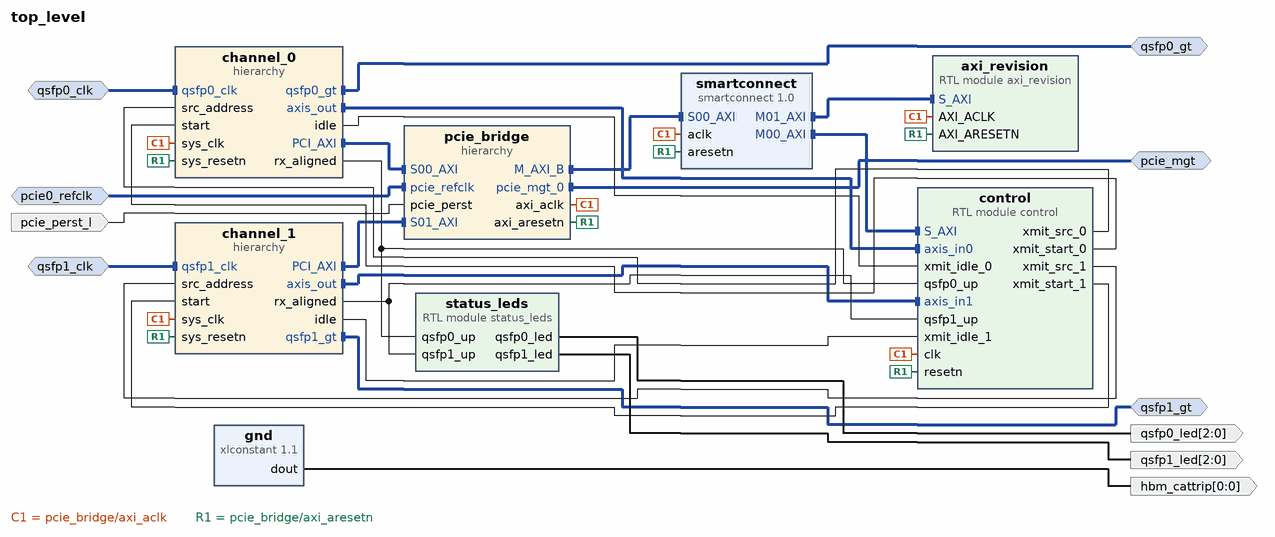
[diagram p0: block diagram of the top level]
# Vivado block design top_level, xcu55c-fsvh2892-2L-e, Vivado 2024.2
create_bd_design top_level

create_bd_intf_port -mode Slave -vlnv xilinx.com:interface:diff_clock_rtl:1.0 pcie0_refclk
create_bd_intf_port -mode Master -vlnv xilinx.com:interface:pcie_7x_mgt_rtl:1.0 pcie_mgt
create_bd_intf_port -mode Master -vlnv xilinx.com:interface:gt_rtl:1.0 qsfp0_gt
create_bd_intf_port -mode Slave -vlnv xilinx.com:interface:diff_clock_rtl:1.0 qsfp0_clk
set_property -dict {CONFIG.FREQ_HZ 161132812} [get_bd_intf_ports qsfp0_clk]
create_bd_intf_port -mode Master -vlnv xilinx.com:interface:gt_rtl:1.0 qsfp1_gt
create_bd_intf_port -mode Slave -vlnv xilinx.com:interface:diff_clock_rtl:1.0 qsfp1_clk
set_property -dict {CONFIG.FREQ_HZ 161132812} [get_bd_intf_ports qsfp1_clk]
create_bd_port -dir I -type rst pcie_perst_l
create_bd_port -dir O -from 0 -to 0 hbm_cattrip
create_bd_port -dir O -from 2 -to 0 qsfp0_led
create_bd_port -dir O -from 2 -to 0 qsfp1_led

create_bd_cell -type hier pcie_bridge
create_bd_cell -type ip -vlnv xilinx.com:ip:smartconnect:1.0 smartconnect
set_property -dict {CONFIG.NUM_MI 2 CONFIG.NUM_SI 1} [get_bd_cells smartconnect]
create_bd_cell -type ip -vlnv xilinx.com:ip:xlconstant:1.1 gnd
set_property -dict {CONFIG.CONST_VAL 0} [get_bd_cells gnd]
create_bd_cell -type module -reference control control
create_bd_cell -type module -reference status_leds status_leds
create_bd_cell -type hier channel_0
create_bd_cell -type hier channel_1
create_bd_cell -type module -reference axi_revision axi_revision

# ---- hierarchy /pcie_bridge ----
current_bd_instance /pcie_bridge
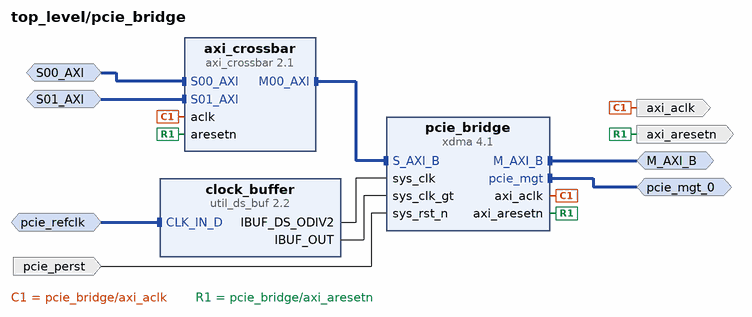
[diagram p1: block diagram inside /pcie_bridge]
create_bd_intf_pin -mode Master -vlnv xilinx.com:interface:pcie_7x_mgt_rtl:1.0 pcie_mgt_0
create_bd_intf_pin -mode Slave -vlnv xilinx.com:interface:diff_clock_rtl:1.0 pcie_refclk
create_bd_intf_pin -mode Master -vlnv xilinx.com:interface:aximm_rtl:1.0 M_AXI_B
create_bd_intf_pin -mode Slave -vlnv xilinx.com:interface:aximm_rtl:1.0 S00_AXI
create_bd_intf_pin -mode Slave -vlnv xilinx.com:interface:aximm_rtl:1.0 S01_AXI
create_bd_pin -dir I -type rst pcie_perst
create_bd_pin -dir O axi_aclk
create_bd_pin -dir O axi_aresetn

create_bd_cell -type ip -vlnv xilinx.com:ip:xdma:4.1 pcie_bridge
set_property -dict [list \
  CONFIG.PF0_DEVICE_ID_mqdma 9048 \
  CONFIG.PF0_SRIOV_VF_DEVICE_ID A048 \
  CONFIG.PF2_DEVICE_ID_mqdma 9248 \
  CONFIG.PF3_DEVICE_ID_mqdma 9348 \
  CONFIG.axi_addr_width 64 \
  CONFIG.axi_data_width 512_bit \
  CONFIG.axisten_freq 250 \
  CONFIG.bridge_burst true \
  CONFIG.en_axi_slave_if true \
  CONFIG.en_gt_selection false \
  CONFIG.functional_mode AXI_Bridge \
  CONFIG.mode_selection Advanced \
  CONFIG.pcie_blk_locn PCIE4C_X1Y1 \
  CONFIG.pf0_bar0_scale Megabytes \
  CONFIG.pf0_bar0_size 1 \
  CONFIG.pf0_device_id 903f \
  CONFIG.pf0_msi_enabled false \
  CONFIG.pl_link_cap_max_link_speed 16.0_GT/s \
  CONFIG.pl_link_cap_max_link_width X8 \
  CONFIG.runbit_fix false \
  CONFIG.xlnx_ref_board None \
] [get_bd_cells pcie_bridge]
create_bd_cell -type ip -vlnv xilinx.com:ip:util_ds_buf:2.2 clock_buffer
set_property -dict {CONFIG.C_BUF_TYPE IBUFDSGTE} [get_bd_cells clock_buffer]
create_bd_cell -type ip -vlnv xilinx.com:ip:axi_crossbar:2.1 axi_crossbar
set_property -dict [list \
  CONFIG.M00_S00_WRITE_CONNECTIVITY 0 \
  CONFIG.M00_S01_WRITE_CONNECTIVITY 0 \
  CONFIG.NUM_MI 1 \
  CONFIG.NUM_SI 2 \
  CONFIG.STRATEGY 2 \
] [get_bd_cells axi_crossbar]

# ---- hierarchy /channel_0 ----
current_bd_instance /channel_0
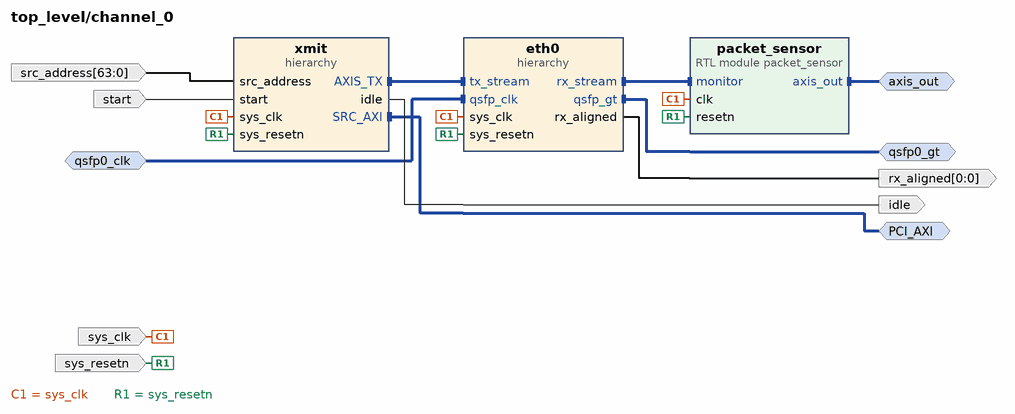
[diagram p2: block diagram inside /channel_0]
create_bd_intf_pin -mode Master -vlnv xilinx.com:interface:gt_rtl:1.0 qsfp0_gt
create_bd_intf_pin -mode Slave -vlnv xilinx.com:interface:diff_clock_rtl:1.0 qsfp0_clk
create_bd_intf_pin -mode Master -vlnv xilinx.com:interface:axis_rtl:1.0 axis_out
create_bd_intf_pin -mode Master -vlnv xilinx.com:interface:aximm_rtl:1.0 PCI_AXI
create_bd_pin -dir I sys_clk
create_bd_pin -dir I sys_resetn
create_bd_pin -dir O -from 0 -to 0 rx_aligned
create_bd_pin -dir I start
create_bd_pin -dir I -from 63 -to 0 src_address
create_bd_pin -dir O idle

create_bd_cell -type module -reference packet_sensor packet_sensor
create_bd_cell -type hier eth0
create_bd_cell -type hier xmit

# ---- hierarchy /channel_0/eth0 ----
current_bd_instance /channel_0/eth0
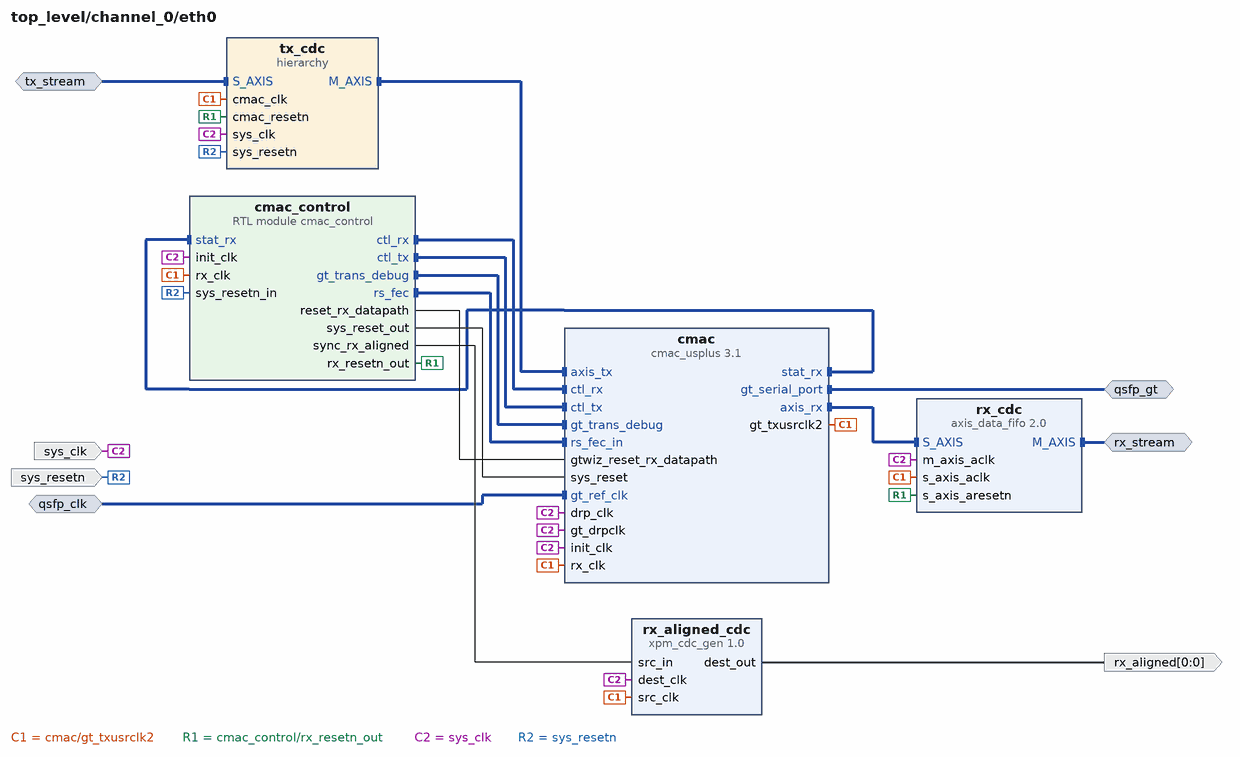
[diagram p3: block diagram inside /channel_0/eth0]
create_bd_intf_pin -mode Master -vlnv xilinx.com:interface:gt_rtl:1.0 qsfp_gt
create_bd_intf_pin -mode Slave -vlnv xilinx.com:interface:diff_clock_rtl:1.0 qsfp_clk
create_bd_intf_pin -mode Master -vlnv xilinx.com:interface:axis_rtl:1.0 rx_stream
create_bd_intf_pin -mode Slave -vlnv xilinx.com:interface:axis_rtl:1.0 tx_stream
create_bd_pin -dir I sys_clk
create_bd_pin -dir I sys_resetn
create_bd_pin -dir O -from 0 -to 0 rx_aligned

create_bd_cell -type ip -vlnv xilinx.com:ip:cmac_usplus:3.1 cmac
set_property -dict [list \
  CONFIG.ADD_GT_CNRL_STS_PORTS 1 \
  CONFIG.CMAC_CAUI4_MODE 1 \
  CONFIG.GT_DRP_CLK 250 \
  CONFIG.INCLUDE_RS_FEC 1 \
  CONFIG.RX_FLOW_CONTROL 0 \
  CONFIG.TX_FLOW_CONTROL 0 \
  CONFIG.USER_INTERFACE AXIS \
] [get_bd_cells cmac]
create_bd_cell -type module -reference cmac_control cmac_control
create_bd_cell -type ip -vlnv xilinx.com:ip:axis_data_fifo:2.0 rx_cdc
set_property -dict {CONFIG.IS_ACLK_ASYNC 1} [get_bd_cells rx_cdc]
create_bd_cell -type ip -vlnv xilinx.com:ip:xpm_cdc_gen:1.0 rx_aligned_cdc
set_property -dict [list \
  CONFIG.CDC_TYPE xpm_cdc_single \
  CONFIG.SIM_ASSERT_CHK false \
  CONFIG.SRC_INPUT_REG false \
] [get_bd_cells rx_aligned_cdc]
create_bd_cell -type hier tx_cdc

# ---- hierarchy /channel_0/eth0/tx_cdc ----
current_bd_instance /channel_0/eth0/tx_cdc
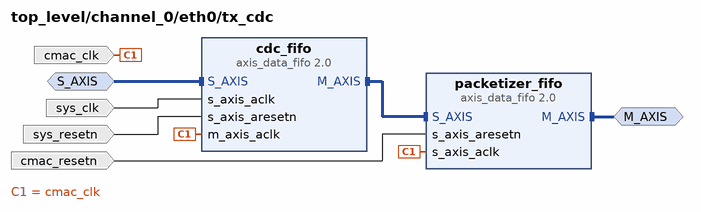
[diagram p4: block diagram inside /channel_0/eth0/tx_cdc]
create_bd_intf_pin -mode Slave -vlnv xilinx.com:interface:axis_rtl:1.0 S_AXIS
create_bd_intf_pin -mode Master -vlnv xilinx.com:interface:axis_rtl:1.0 M_AXIS
create_bd_pin -dir I sys_resetn
create_bd_pin -dir I sys_clk
create_bd_pin -dir I -type clk cmac_clk
create_bd_pin -dir I -type rst cmac_resetn

create_bd_cell -type ip -vlnv xilinx.com:ip:axis_data_fifo:2.0 cdc_fifo
set_property -dict {CONFIG.FIFO_DEPTH 16 CONFIG.IS_ACLK_ASYNC 1} [get_bd_cells cdc_fifo]
create_bd_cell -type ip -vlnv xilinx.com:ip:axis_data_fifo:2.0 packetizer_fifo
set_property -dict {CONFIG.FIFO_MODE 2} [get_bd_cells packetizer_fifo]

# ---- hierarchy /channel_0/xmit ----
current_bd_instance /channel_0/xmit
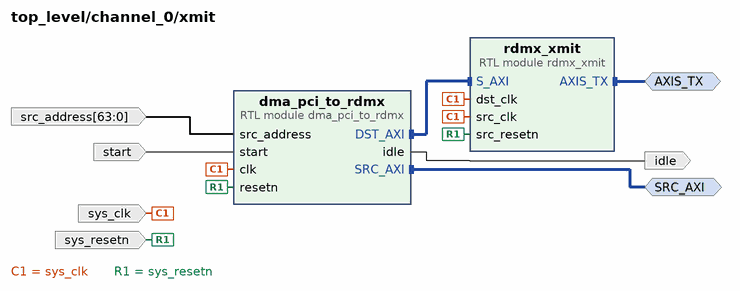
[diagram p5: block diagram inside /channel_0/xmit]
create_bd_intf_pin -mode Master -vlnv xilinx.com:interface:aximm_rtl:1.0 SRC_AXI
create_bd_intf_pin -mode Master -vlnv xilinx.com:interface:axis_rtl:1.0 AXIS_TX
create_bd_pin -dir I sys_clk
create_bd_pin -dir I sys_resetn
create_bd_pin -dir I -from 63 -to 0 src_address
create_bd_pin -dir I start
create_bd_pin -dir O idle

create_bd_cell -type module -reference dma_pci_to_rdmx dma_pci_to_rdmx
create_bd_cell -type module -reference rdmx_xmit rdmx_xmit
set_property -dict {CONFIG.SRC_MAC 0} [get_bd_cells rdmx_xmit]

# ---- hierarchy /channel_1 ----
current_bd_instance /channel_1
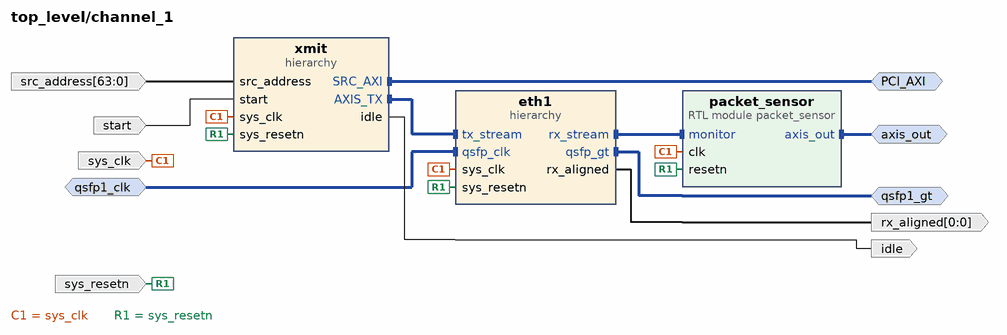
[diagram p6: block diagram inside /channel_1]
create_bd_intf_pin -mode Master -vlnv xilinx.com:interface:axis_rtl:1.0 axis_out
create_bd_intf_pin -mode Master -vlnv xilinx.com:interface:gt_rtl:1.0 qsfp1_gt
create_bd_intf_pin -mode Slave -vlnv xilinx.com:interface:diff_clock_rtl:1.0 qsfp1_clk
create_bd_intf_pin -mode Master -vlnv xilinx.com:interface:aximm_rtl:1.0 PCI_AXI
create_bd_pin -dir I sys_clk
create_bd_pin -dir I sys_resetn
create_bd_pin -dir O -from 0 -to 0 rx_aligned
create_bd_pin -dir I -from 63 -to 0 src_address
create_bd_pin -dir I start
create_bd_pin -dir O idle

create_bd_cell -type module -reference packet_sensor packet_sensor
create_bd_cell -type hier eth1
create_bd_cell -type hier xmit

# ---- hierarchy /channel_1/eth1 ----
current_bd_instance /channel_1/eth1
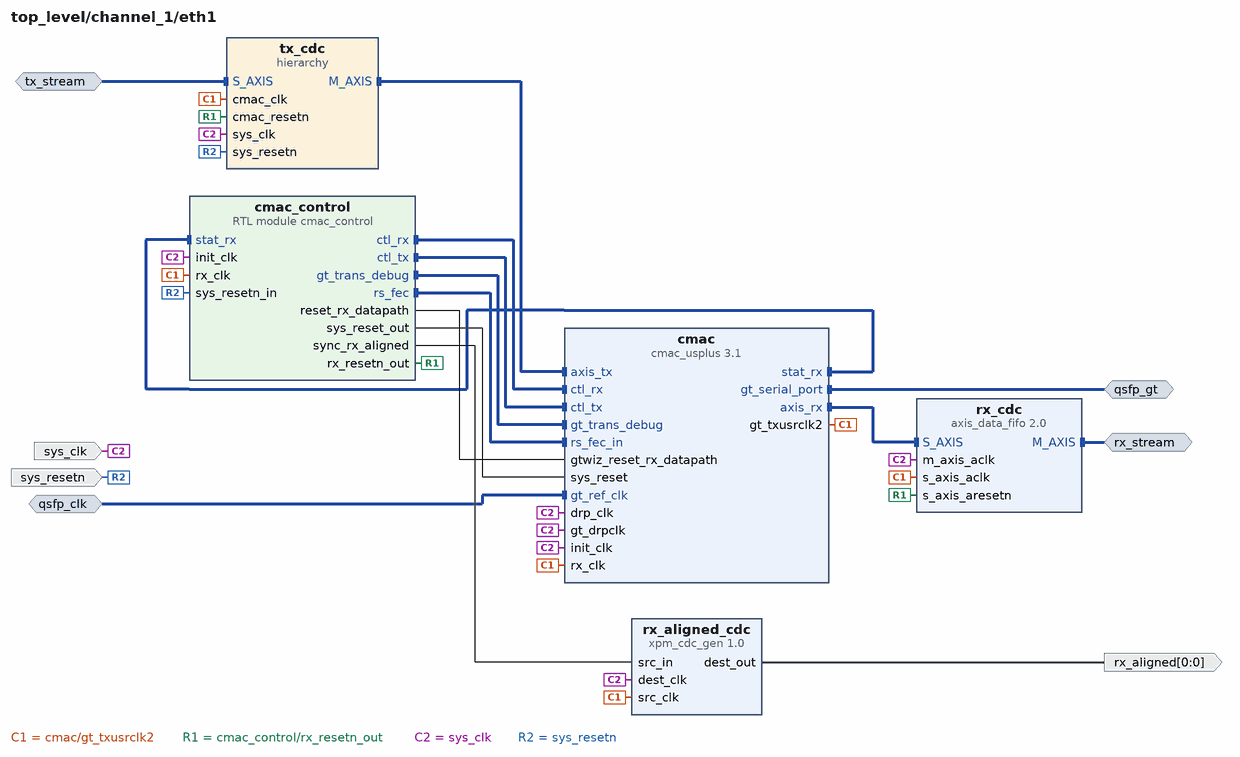
[diagram p7: block diagram inside /channel_1/eth1]
create_bd_intf_pin -mode Master -vlnv xilinx.com:interface:gt_rtl:1.0 qsfp_gt
create_bd_intf_pin -mode Slave -vlnv xilinx.com:interface:diff_clock_rtl:1.0 qsfp_clk
create_bd_intf_pin -mode Master -vlnv xilinx.com:interface:axis_rtl:1.0 rx_stream
create_bd_intf_pin -mode Slave -vlnv xilinx.com:interface:axis_rtl:1.0 tx_stream
create_bd_pin -dir I sys_clk
create_bd_pin -dir I sys_resetn
create_bd_pin -dir O -from 0 -to 0 rx_aligned

create_bd_cell -type ip -vlnv xilinx.com:ip:cmac_usplus:3.1 cmac
set_property -dict [list \
  CONFIG.ADD_GT_CNRL_STS_PORTS 1 \
  CONFIG.CMAC_CAUI4_MODE 1 \
  CONFIG.CMAC_CORE_SELECT CMACE4_X0Y4 \
  CONFIG.GT_DRP_CLK 250 \
  CONFIG.GT_GROUP_SELECT {X0Y28~X0Y31} \
  CONFIG.INCLUDE_RS_FEC 1 \
  CONFIG.RX_FLOW_CONTROL 0 \
  CONFIG.TX_FLOW_CONTROL 0 \
  CONFIG.USER_INTERFACE AXIS \
] [get_bd_cells cmac]
create_bd_cell -type module -reference cmac_control cmac_control
create_bd_cell -type ip -vlnv xilinx.com:ip:axis_data_fifo:2.0 rx_cdc
set_property -dict {CONFIG.IS_ACLK_ASYNC 1} [get_bd_cells rx_cdc]
create_bd_cell -type ip -vlnv xilinx.com:ip:xpm_cdc_gen:1.0 rx_aligned_cdc
set_property -dict [list \
  CONFIG.CDC_TYPE xpm_cdc_single \
  CONFIG.SIM_ASSERT_CHK false \
  CONFIG.SRC_INPUT_REG false \
] [get_bd_cells rx_aligned_cdc]
create_bd_cell -type hier tx_cdc

# ---- hierarchy /channel_1/eth1/tx_cdc ----
current_bd_instance /channel_1/eth1/tx_cdc
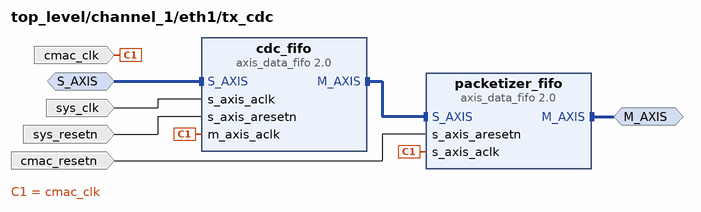
[diagram p8: block diagram inside /channel_1/eth1/tx_cdc]
create_bd_intf_pin -mode Slave -vlnv xilinx.com:interface:axis_rtl:1.0 S_AXIS
create_bd_intf_pin -mode Master -vlnv xilinx.com:interface:axis_rtl:1.0 M_AXIS
create_bd_pin -dir I sys_resetn
create_bd_pin -dir I sys_clk
create_bd_pin -dir I -type clk cmac_clk
create_bd_pin -dir I -type rst cmac_resetn

create_bd_cell -type ip -vlnv xilinx.com:ip:axis_data_fifo:2.0 cdc_fifo
set_property -dict {CONFIG.FIFO_DEPTH 16 CONFIG.IS_ACLK_ASYNC 1} [get_bd_cells cdc_fifo]
create_bd_cell -type ip -vlnv xilinx.com:ip:axis_data_fifo:2.0 packetizer_fifo
set_property -dict {CONFIG.FIFO_MODE 2} [get_bd_cells packetizer_fifo]

# ---- hierarchy /channel_1/xmit ----
current_bd_instance /channel_1/xmit
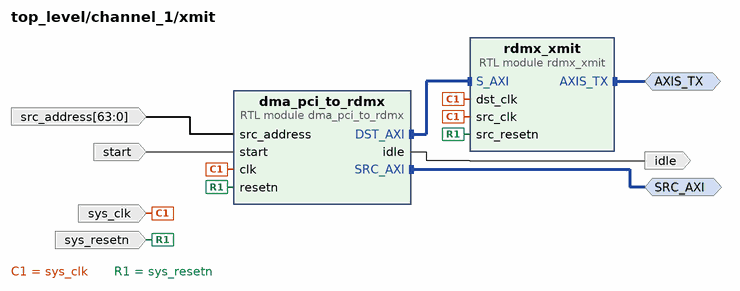
[diagram p9: block diagram inside /channel_1/xmit]
create_bd_intf_pin -mode Master -vlnv xilinx.com:interface:aximm_rtl:1.0 SRC_AXI
create_bd_intf_pin -mode Master -vlnv xilinx.com:interface:axis_rtl:1.0 AXIS_TX
create_bd_pin -dir I sys_clk
create_bd_pin -dir I sys_resetn
create_bd_pin -dir I -from 63 -to 0 src_address
create_bd_pin -dir I start
create_bd_pin -dir O idle

create_bd_cell -type module -reference dma_pci_to_rdmx dma_pci_to_rdmx
create_bd_cell -type module -reference rdmx_xmit rdmx_xmit
set_property -dict {CONFIG.SRC_MAC 1} [get_bd_cells rdmx_xmit]

# ---- connections ----

current_bd_instance /pcie_bridge
connect_bd_intf_net [get_bd_intf_pins pcie_refclk] [get_bd_intf_pins clock_buffer/CLK_IN_D]
connect_bd_intf_net [get_bd_intf_pins S00_AXI] [get_bd_intf_pins axi_crossbar/S00_AXI]
connect_bd_intf_net [get_bd_intf_pins S01_AXI] [get_bd_intf_pins axi_crossbar/S01_AXI]
connect_bd_intf_net [get_bd_intf_pins axi_crossbar/M00_AXI] [get_bd_intf_pins pcie_bridge/S_AXI_B]
connect_bd_intf_net [get_bd_intf_pins M_AXI_B] [get_bd_intf_pins pcie_bridge/M_AXI_B]
connect_bd_intf_net [get_bd_intf_pins pcie_mgt_0] [get_bd_intf_pins pcie_bridge/pcie_mgt]
connect_bd_net -net sys_rst_n_0_1 [get_bd_pins pcie_perst] [get_bd_pins pcie_bridge/sys_rst_n]
connect_bd_net -net util_ds_buf_0_IBUF_DS_ODIV2 [get_bd_pins clock_buffer/IBUF_DS_ODIV2] [get_bd_pins pcie_bridge/sys_clk]
connect_bd_net -net util_ds_buf_0_IBUF_OUT [get_bd_pins clock_buffer/IBUF_OUT] [get_bd_pins pcie_bridge/sys_clk_gt]
connect_bd_net -net xdma_0_axi_aclk [get_bd_pins pcie_bridge/axi_aclk] [get_bd_pins axi_aclk] [get_bd_pins axi_crossbar/aclk]
connect_bd_net -net xdma_0_axi_aresetn [get_bd_pins pcie_bridge/axi_aresetn] [get_bd_pins axi_aresetn] [get_bd_pins axi_crossbar/aresetn]

current_bd_instance /channel_0
connect_bd_intf_net [get_bd_intf_pins qsfp0_gt] [get_bd_intf_pins eth0/qsfp_gt]
connect_bd_intf_net [get_bd_intf_pins packet_sensor/monitor] [get_bd_intf_pins eth0/rx_stream]
connect_bd_intf_net [get_bd_intf_pins axis_out] [get_bd_intf_pins packet_sensor/axis_out]
connect_bd_intf_net [get_bd_intf_pins qsfp0_clk] [get_bd_intf_pins eth0/qsfp_clk]
connect_bd_intf_net [get_bd_intf_pins xmit/AXIS_TX] [get_bd_intf_pins eth0/tx_stream]
connect_bd_intf_net [get_bd_intf_pins PCI_AXI] [get_bd_intf_pins xmit/SRC_AXI]
connect_bd_net [get_bd_pins eth0/rx_aligned] [get_bd_pins rx_aligned]
connect_bd_net -net pcie_bridge_0_axi_aclk [get_bd_pins sys_clk] [get_bd_pins eth0/sys_clk] [get_bd_pins packet_sensor/clk] [get_bd_pins xmit/sys_clk]
connect_bd_net -net pcie_bridge_0_axi_aresetn [get_bd_pins sys_resetn] \
  [get_bd_pins eth0/sys_resetn] [get_bd_pins packet_sensor/resetn] [get_bd_pins xmit/sys_resetn]
connect_bd_net [get_bd_pins src_address] [get_bd_pins xmit/src_address]
connect_bd_net [get_bd_pins start] [get_bd_pins xmit/start]
connect_bd_net [get_bd_pins xmit/idle] [get_bd_pins idle]

current_bd_instance /channel_0/eth0
connect_bd_intf_net [get_bd_intf_pins cmac/axis_rx] [get_bd_intf_pins rx_cdc/S_AXIS]
connect_bd_intf_net [get_bd_intf_pins cmac_control/ctl_rx] [get_bd_intf_pins cmac/ctl_rx]
connect_bd_intf_net [get_bd_intf_pins cmac_control/ctl_tx] [get_bd_intf_pins cmac/ctl_tx]
connect_bd_intf_net [get_bd_intf_pins cmac_control/gt_trans_debug] [get_bd_intf_pins cmac/gt_trans_debug]
connect_bd_intf_net [get_bd_intf_pins cmac_control/rs_fec] [get_bd_intf_pins cmac/rs_fec_in]
connect_bd_intf_net [get_bd_intf_pins qsfp_gt] [get_bd_intf_pins cmac/gt_serial_port]
connect_bd_intf_net [get_bd_intf_pins cmac_control/stat_rx] [get_bd_intf_pins cmac/stat_rx]
connect_bd_intf_net [get_bd_intf_pins tx_cdc/M_AXIS] [get_bd_intf_pins cmac/axis_tx]
connect_bd_intf_net [get_bd_intf_pins qsfp_clk] [get_bd_intf_pins cmac/gt_ref_clk]
connect_bd_intf_net [get_bd_intf_pins rx_stream] [get_bd_intf_pins rx_cdc/M_AXIS]
connect_bd_intf_net [get_bd_intf_pins tx_stream] [get_bd_intf_pins tx_cdc/S_AXIS]
connect_bd_net [get_bd_pins cmac/gt_txusrclk2] \
  [get_bd_pins cmac_control/rx_clk] [get_bd_pins cmac/rx_clk] [get_bd_pins rx_cdc/s_axis_aclk] \
  [get_bd_pins rx_aligned_cdc/src_clk] [get_bd_pins tx_cdc/cmac_clk]
connect_bd_net [get_bd_pins cmac_control/reset_rx_datapath] [get_bd_pins cmac/gtwiz_reset_rx_datapath]
connect_bd_net [get_bd_pins cmac_control/rx_resetn_out] [get_bd_pins rx_cdc/s_axis_aresetn] [get_bd_pins tx_cdc/cmac_resetn]
connect_bd_net [get_bd_pins cmac_control/sync_rx_aligned] [get_bd_pins rx_aligned_cdc/src_in]
connect_bd_net [get_bd_pins cmac_control/sys_reset_out] [get_bd_pins cmac/sys_reset]
connect_bd_net [get_bd_pins rx_aligned_cdc/dest_out] [get_bd_pins rx_aligned]
connect_bd_net [get_bd_pins sys_clk] \
  [get_bd_pins cmac/drp_clk] [get_bd_pins cmac/init_clk] [get_bd_pins cmac/gt_drpclk] [get_bd_pins cmac_control/init_clk] \
  [get_bd_pins rx_cdc/m_axis_aclk] [get_bd_pins rx_aligned_cdc/dest_clk] [get_bd_pins tx_cdc/sys_clk]
connect_bd_net [get_bd_pins sys_resetn] [get_bd_pins cmac_control/sys_resetn_in] [get_bd_pins tx_cdc/sys_resetn]

current_bd_instance /channel_0/eth0/tx_cdc
connect_bd_intf_net [get_bd_intf_pins cdc_fifo/M_AXIS] [get_bd_intf_pins packetizer_fifo/S_AXIS]
connect_bd_intf_net [get_bd_intf_pins M_AXIS] [get_bd_intf_pins packetizer_fifo/M_AXIS]
connect_bd_intf_net [get_bd_intf_pins S_AXIS] [get_bd_intf_pins cdc_fifo/S_AXIS]
connect_bd_net [get_bd_pins cmac_clk] [get_bd_pins packetizer_fifo/s_axis_aclk] [get_bd_pins cdc_fifo/m_axis_aclk]
connect_bd_net -net cmac_control_rx_resetn_out [get_bd_pins cmac_resetn] [get_bd_pins packetizer_fifo/s_axis_aresetn]
connect_bd_net [get_bd_pins sys_clk] [get_bd_pins cdc_fifo/s_axis_aclk]
connect_bd_net [get_bd_pins sys_resetn] [get_bd_pins cdc_fifo/s_axis_aresetn]

current_bd_instance /channel_0/xmit
connect_bd_intf_net [get_bd_intf_pins dma_pci_to_rdmx/DST_AXI] [get_bd_intf_pins rdmx_xmit/S_AXI]
connect_bd_intf_net [get_bd_intf_pins SRC_AXI] [get_bd_intf_pins dma_pci_to_rdmx/SRC_AXI]
connect_bd_intf_net [get_bd_intf_pins AXIS_TX] [get_bd_intf_pins rdmx_xmit/AXIS_TX]
connect_bd_net [get_bd_pins dma_pci_to_rdmx/idle] [get_bd_pins idle]
connect_bd_net -net pcie_bridge_0_axi_aclk [get_bd_pins sys_clk] \
  [get_bd_pins rdmx_xmit/dst_clk] [get_bd_pins rdmx_xmit/src_clk] [get_bd_pins dma_pci_to_rdmx/clk]
connect_bd_net -net pcie_bridge_0_axi_aresetn [get_bd_pins sys_resetn] [get_bd_pins rdmx_xmit/src_resetn] [get_bd_pins dma_pci_to_rdmx/resetn]
connect_bd_net [get_bd_pins src_address] [get_bd_pins dma_pci_to_rdmx/src_address]
connect_bd_net [get_bd_pins start] [get_bd_pins dma_pci_to_rdmx/start]

current_bd_instance /channel_1
connect_bd_intf_net [get_bd_intf_pins PCI_AXI] [get_bd_intf_pins xmit/SRC_AXI]
connect_bd_intf_net [get_bd_intf_pins qsfp1_gt] [get_bd_intf_pins eth1/qsfp_gt]
connect_bd_intf_net [get_bd_intf_pins packet_sensor/monitor] [get_bd_intf_pins eth1/rx_stream]
connect_bd_intf_net [get_bd_intf_pins axis_out] [get_bd_intf_pins packet_sensor/axis_out]
connect_bd_intf_net [get_bd_intf_pins qsfp1_clk] [get_bd_intf_pins eth1/qsfp_clk]
connect_bd_intf_net [get_bd_intf_pins xmit/AXIS_TX] [get_bd_intf_pins eth1/tx_stream]
connect_bd_net [get_bd_pins eth1/rx_aligned] [get_bd_pins rx_aligned]
connect_bd_net -net pcie_bridge_0_axi_aclk [get_bd_pins sys_clk] [get_bd_pins eth1/sys_clk] [get_bd_pins packet_sensor/clk] [get_bd_pins xmit/sys_clk]
connect_bd_net -net pcie_bridge_0_axi_aresetn [get_bd_pins sys_resetn] \
  [get_bd_pins eth1/sys_resetn] [get_bd_pins packet_sensor/resetn] [get_bd_pins xmit/sys_resetn]
connect_bd_net [get_bd_pins src_address] [get_bd_pins xmit/src_address]
connect_bd_net [get_bd_pins start] [get_bd_pins xmit/start]
connect_bd_net [get_bd_pins xmit/idle] [get_bd_pins idle]

current_bd_instance /channel_1/eth1
connect_bd_intf_net [get_bd_intf_pins cmac/axis_rx] [get_bd_intf_pins rx_cdc/S_AXIS]
connect_bd_intf_net [get_bd_intf_pins cmac_control/ctl_rx] [get_bd_intf_pins cmac/ctl_rx]
connect_bd_intf_net [get_bd_intf_pins cmac_control/ctl_tx] [get_bd_intf_pins cmac/ctl_tx]
connect_bd_intf_net [get_bd_intf_pins cmac_control/gt_trans_debug] [get_bd_intf_pins cmac/gt_trans_debug]
connect_bd_intf_net [get_bd_intf_pins cmac_control/rs_fec] [get_bd_intf_pins cmac/rs_fec_in]
connect_bd_intf_net [get_bd_intf_pins qsfp_gt] [get_bd_intf_pins cmac/gt_serial_port]
connect_bd_intf_net [get_bd_intf_pins cmac_control/stat_rx] [get_bd_intf_pins cmac/stat_rx]
connect_bd_intf_net [get_bd_intf_pins tx_cdc/M_AXIS] [get_bd_intf_pins cmac/axis_tx]
connect_bd_intf_net [get_bd_intf_pins qsfp_clk] [get_bd_intf_pins cmac/gt_ref_clk]
connect_bd_intf_net [get_bd_intf_pins rx_stream] [get_bd_intf_pins rx_cdc/M_AXIS]
connect_bd_intf_net [get_bd_intf_pins tx_stream] [get_bd_intf_pins tx_cdc/S_AXIS]
connect_bd_net [get_bd_pins cmac/gt_txusrclk2] \
  [get_bd_pins cmac_control/rx_clk] [get_bd_pins cmac/rx_clk] [get_bd_pins rx_cdc/s_axis_aclk] \
  [get_bd_pins rx_aligned_cdc/src_clk] [get_bd_pins tx_cdc/cmac_clk]
connect_bd_net [get_bd_pins cmac_control/reset_rx_datapath] [get_bd_pins cmac/gtwiz_reset_rx_datapath]
connect_bd_net [get_bd_pins cmac_control/rx_resetn_out] [get_bd_pins rx_cdc/s_axis_aresetn] [get_bd_pins tx_cdc/cmac_resetn]
connect_bd_net [get_bd_pins cmac_control/sync_rx_aligned] [get_bd_pins rx_aligned_cdc/src_in]
connect_bd_net [get_bd_pins cmac_control/sys_reset_out] [get_bd_pins cmac/sys_reset]
connect_bd_net [get_bd_pins rx_aligned_cdc/dest_out] [get_bd_pins rx_aligned]
connect_bd_net [get_bd_pins sys_clk] \
  [get_bd_pins cmac/drp_clk] [get_bd_pins cmac/init_clk] [get_bd_pins cmac/gt_drpclk] [get_bd_pins cmac_control/init_clk] \
  [get_bd_pins rx_cdc/m_axis_aclk] [get_bd_pins rx_aligned_cdc/dest_clk] [get_bd_pins tx_cdc/sys_clk]
connect_bd_net [get_bd_pins sys_resetn] [get_bd_pins cmac_control/sys_resetn_in] [get_bd_pins tx_cdc/sys_resetn]

current_bd_instance /channel_1/eth1/tx_cdc
connect_bd_intf_net [get_bd_intf_pins cdc_fifo/M_AXIS] [get_bd_intf_pins packetizer_fifo/S_AXIS]
connect_bd_intf_net [get_bd_intf_pins M_AXIS] [get_bd_intf_pins packetizer_fifo/M_AXIS]
connect_bd_intf_net [get_bd_intf_pins S_AXIS] [get_bd_intf_pins cdc_fifo/S_AXIS]
connect_bd_net [get_bd_pins cmac_clk] [get_bd_pins packetizer_fifo/s_axis_aclk] [get_bd_pins cdc_fifo/m_axis_aclk]
connect_bd_net -net cmac_control_rx_resetn_out [get_bd_pins cmac_resetn] [get_bd_pins packetizer_fifo/s_axis_aresetn]
connect_bd_net [get_bd_pins sys_clk] [get_bd_pins cdc_fifo/s_axis_aclk]
connect_bd_net [get_bd_pins sys_resetn] [get_bd_pins cdc_fifo/s_axis_aresetn]

current_bd_instance /channel_1/xmit
connect_bd_intf_net [get_bd_intf_pins dma_pci_to_rdmx/DST_AXI] [get_bd_intf_pins rdmx_xmit/S_AXI]
connect_bd_intf_net [get_bd_intf_pins SRC_AXI] [get_bd_intf_pins dma_pci_to_rdmx/SRC_AXI]
connect_bd_intf_net [get_bd_intf_pins AXIS_TX] [get_bd_intf_pins rdmx_xmit/AXIS_TX]
connect_bd_net [get_bd_pins dma_pci_to_rdmx/idle] [get_bd_pins idle]
connect_bd_net -net pcie_bridge_0_axi_aclk [get_bd_pins sys_clk] \
  [get_bd_pins rdmx_xmit/dst_clk] [get_bd_pins rdmx_xmit/src_clk] [get_bd_pins dma_pci_to_rdmx/clk]
connect_bd_net -net pcie_bridge_0_axi_aresetn [get_bd_pins sys_resetn] [get_bd_pins rdmx_xmit/src_resetn] [get_bd_pins dma_pci_to_rdmx/resetn]
connect_bd_net [get_bd_pins src_address] [get_bd_pins dma_pci_to_rdmx/src_address]
connect_bd_net [get_bd_pins start] [get_bd_pins dma_pci_to_rdmx/start]

current_bd_instance /
connect_bd_intf_net [get_bd_intf_ports pcie0_refclk] [get_bd_intf_pins pcie_bridge/pcie_refclk]
connect_bd_intf_net [get_bd_intf_pins channel_0/PCI_AXI] [get_bd_intf_pins pcie_bridge/S00_AXI]
connect_bd_intf_net [get_bd_intf_pins channel_0/axis_out] [get_bd_intf_pins control/axis_in0]
connect_bd_intf_net [get_bd_intf_pins channel_1/PCI_AXI] [get_bd_intf_pins pcie_bridge/S01_AXI]
connect_bd_intf_net [get_bd_intf_ports qsfp0_gt] [get_bd_intf_pins channel_0/qsfp0_gt]
connect_bd_intf_net [get_bd_intf_ports qsfp1_gt] [get_bd_intf_pins channel_1/qsfp1_gt]
connect_bd_intf_net [get_bd_intf_pins channel_1/axis_out] [get_bd_intf_pins control/axis_in1]
connect_bd_intf_net [get_bd_intf_pins pcie_bridge/M_AXI_B] [get_bd_intf_pins smartconnect/S00_AXI]
connect_bd_intf_net [get_bd_intf_ports qsfp0_clk] [get_bd_intf_pins channel_0/qsfp0_clk]
connect_bd_intf_net [get_bd_intf_ports qsfp1_clk] [get_bd_intf_pins channel_1/qsfp1_clk]
connect_bd_intf_net [get_bd_intf_pins control/S_AXI] [get_bd_intf_pins smartconnect/M00_AXI]
connect_bd_intf_net [get_bd_intf_pins smartconnect/M01_AXI] [get_bd_intf_pins axi_revision/S_AXI]
connect_bd_intf_net [get_bd_intf_ports pcie_mgt] [get_bd_intf_pins pcie_bridge/pcie_mgt_0]
connect_bd_net [get_bd_pins channel_0/idle] [get_bd_pins control/xmit_idle_0]
connect_bd_net [get_bd_pins channel_1/idle] [get_bd_pins control/xmit_idle_1]
connect_bd_net -net eth0_rx_aligned [get_bd_pins channel_0/rx_aligned] [get_bd_pins status_leds/qsfp0_up] [get_bd_pins control/qsfp0_up]
connect_bd_net -net eth1_rx_aligned [get_bd_pins channel_1/rx_aligned] [get_bd_pins status_leds/qsfp1_up] [get_bd_pins control/qsfp1_up]
connect_bd_net [get_bd_pins gnd/dout] [get_bd_ports hbm_cattrip]
connect_bd_net -net pcie_bridge_0_axi_aclk [get_bd_pins pcie_bridge/axi_aclk] \
  [get_bd_pins smartconnect/aclk] [get_bd_pins channel_0/sys_clk] [get_bd_pins channel_1/sys_clk] [get_bd_pins control/clk] \
  [get_bd_pins axi_revision/AXI_ACLK]
connect_bd_net -net pcie_bridge_0_axi_aresetn [get_bd_pins pcie_bridge/axi_aresetn] \
  [get_bd_pins smartconnect/aresetn] [get_bd_pins channel_0/sys_resetn] [get_bd_pins channel_1/sys_resetn] \
  [get_bd_pins control/resetn] [get_bd_pins axi_revision/AXI_ARESETN]
connect_bd_net -net src_address_1 [get_bd_pins control/xmit_src_1] [get_bd_pins channel_1/src_address]
connect_bd_net -net src_address_2 [get_bd_pins control/xmit_src_0] [get_bd_pins channel_0/src_address]
connect_bd_net -net start_1 [get_bd_pins control/xmit_start_1] [get_bd_pins channel_1/start]
connect_bd_net -net start_2 [get_bd_pins control/xmit_start_0] [get_bd_pins channel_0/start]
connect_bd_net -net status_leds_0_qsfp0_led [get_bd_pins status_leds/qsfp0_led] [get_bd_ports qsfp0_led]
connect_bd_net -net status_leds_0_qsfp1_led [get_bd_pins status_leds/qsfp1_led] [get_bd_ports qsfp1_led]
connect_bd_net -net sys_rst_n_0_1 [get_bd_ports pcie_perst_l] [get_bd_pins pcie_bridge/pcie_perst]

# ---- address map ----
assign_bd_address -offset 0x0000000000000000 -range 16E -target_address_space [get_bd_addr_spaces channel_0/xmit/dma_pci_to_rdmx/DST_AXI] [get_bd_addr_segs channel_0/xmit/rdmx_xmit/S_AXI/reg0]
assign_bd_address -offset 0x0000000000000000 -range 16E -target_address_space [get_bd_addr_spaces channel_0/xmit/dma_pci_to_rdmx/SRC_AXI] [get_bd_addr_segs pcie_bridge/pcie_bridge/S_AXI_B/BAR0]
assign_bd_address -offset 0x0000000000000000 -range 16E -target_address_space [get_bd_addr_spaces channel_1/xmit/dma_pci_to_rdmx/DST_AXI] [get_bd_addr_segs channel_1/xmit/rdmx_xmit/S_AXI/reg0]
assign_bd_address -offset 0x0000000000000000 -range 16E -target_address_space [get_bd_addr_spaces channel_1/xmit/dma_pci_to_rdmx/SRC_AXI] [get_bd_addr_segs pcie_bridge/pcie_bridge/S_AXI_B/BAR0]
assign_bd_address -offset 0x0000000000000000 -range 4K -target_address_space [get_bd_addr_spaces pcie_bridge/pcie_bridge/M_AXI_B] [get_bd_addr_segs axi_revision/S_AXI/reg0]
assign_bd_address -offset 0x0000000000001000 -range 4K -target_address_space [get_bd_addr_spaces pcie_bridge/pcie_bridge/M_AXI_B] [get_bd_addr_segs control/S_AXI/reg0]

validate_bd_design
save_bd_design
